# EasyEDA schematic SCH_water-temp_2026-06-27.json
TITLE: WaterTemp; REV: 1.0; Date: 2024-08-01; Sheet: 1/1; Drawn By: bisand; Company: André Biseth
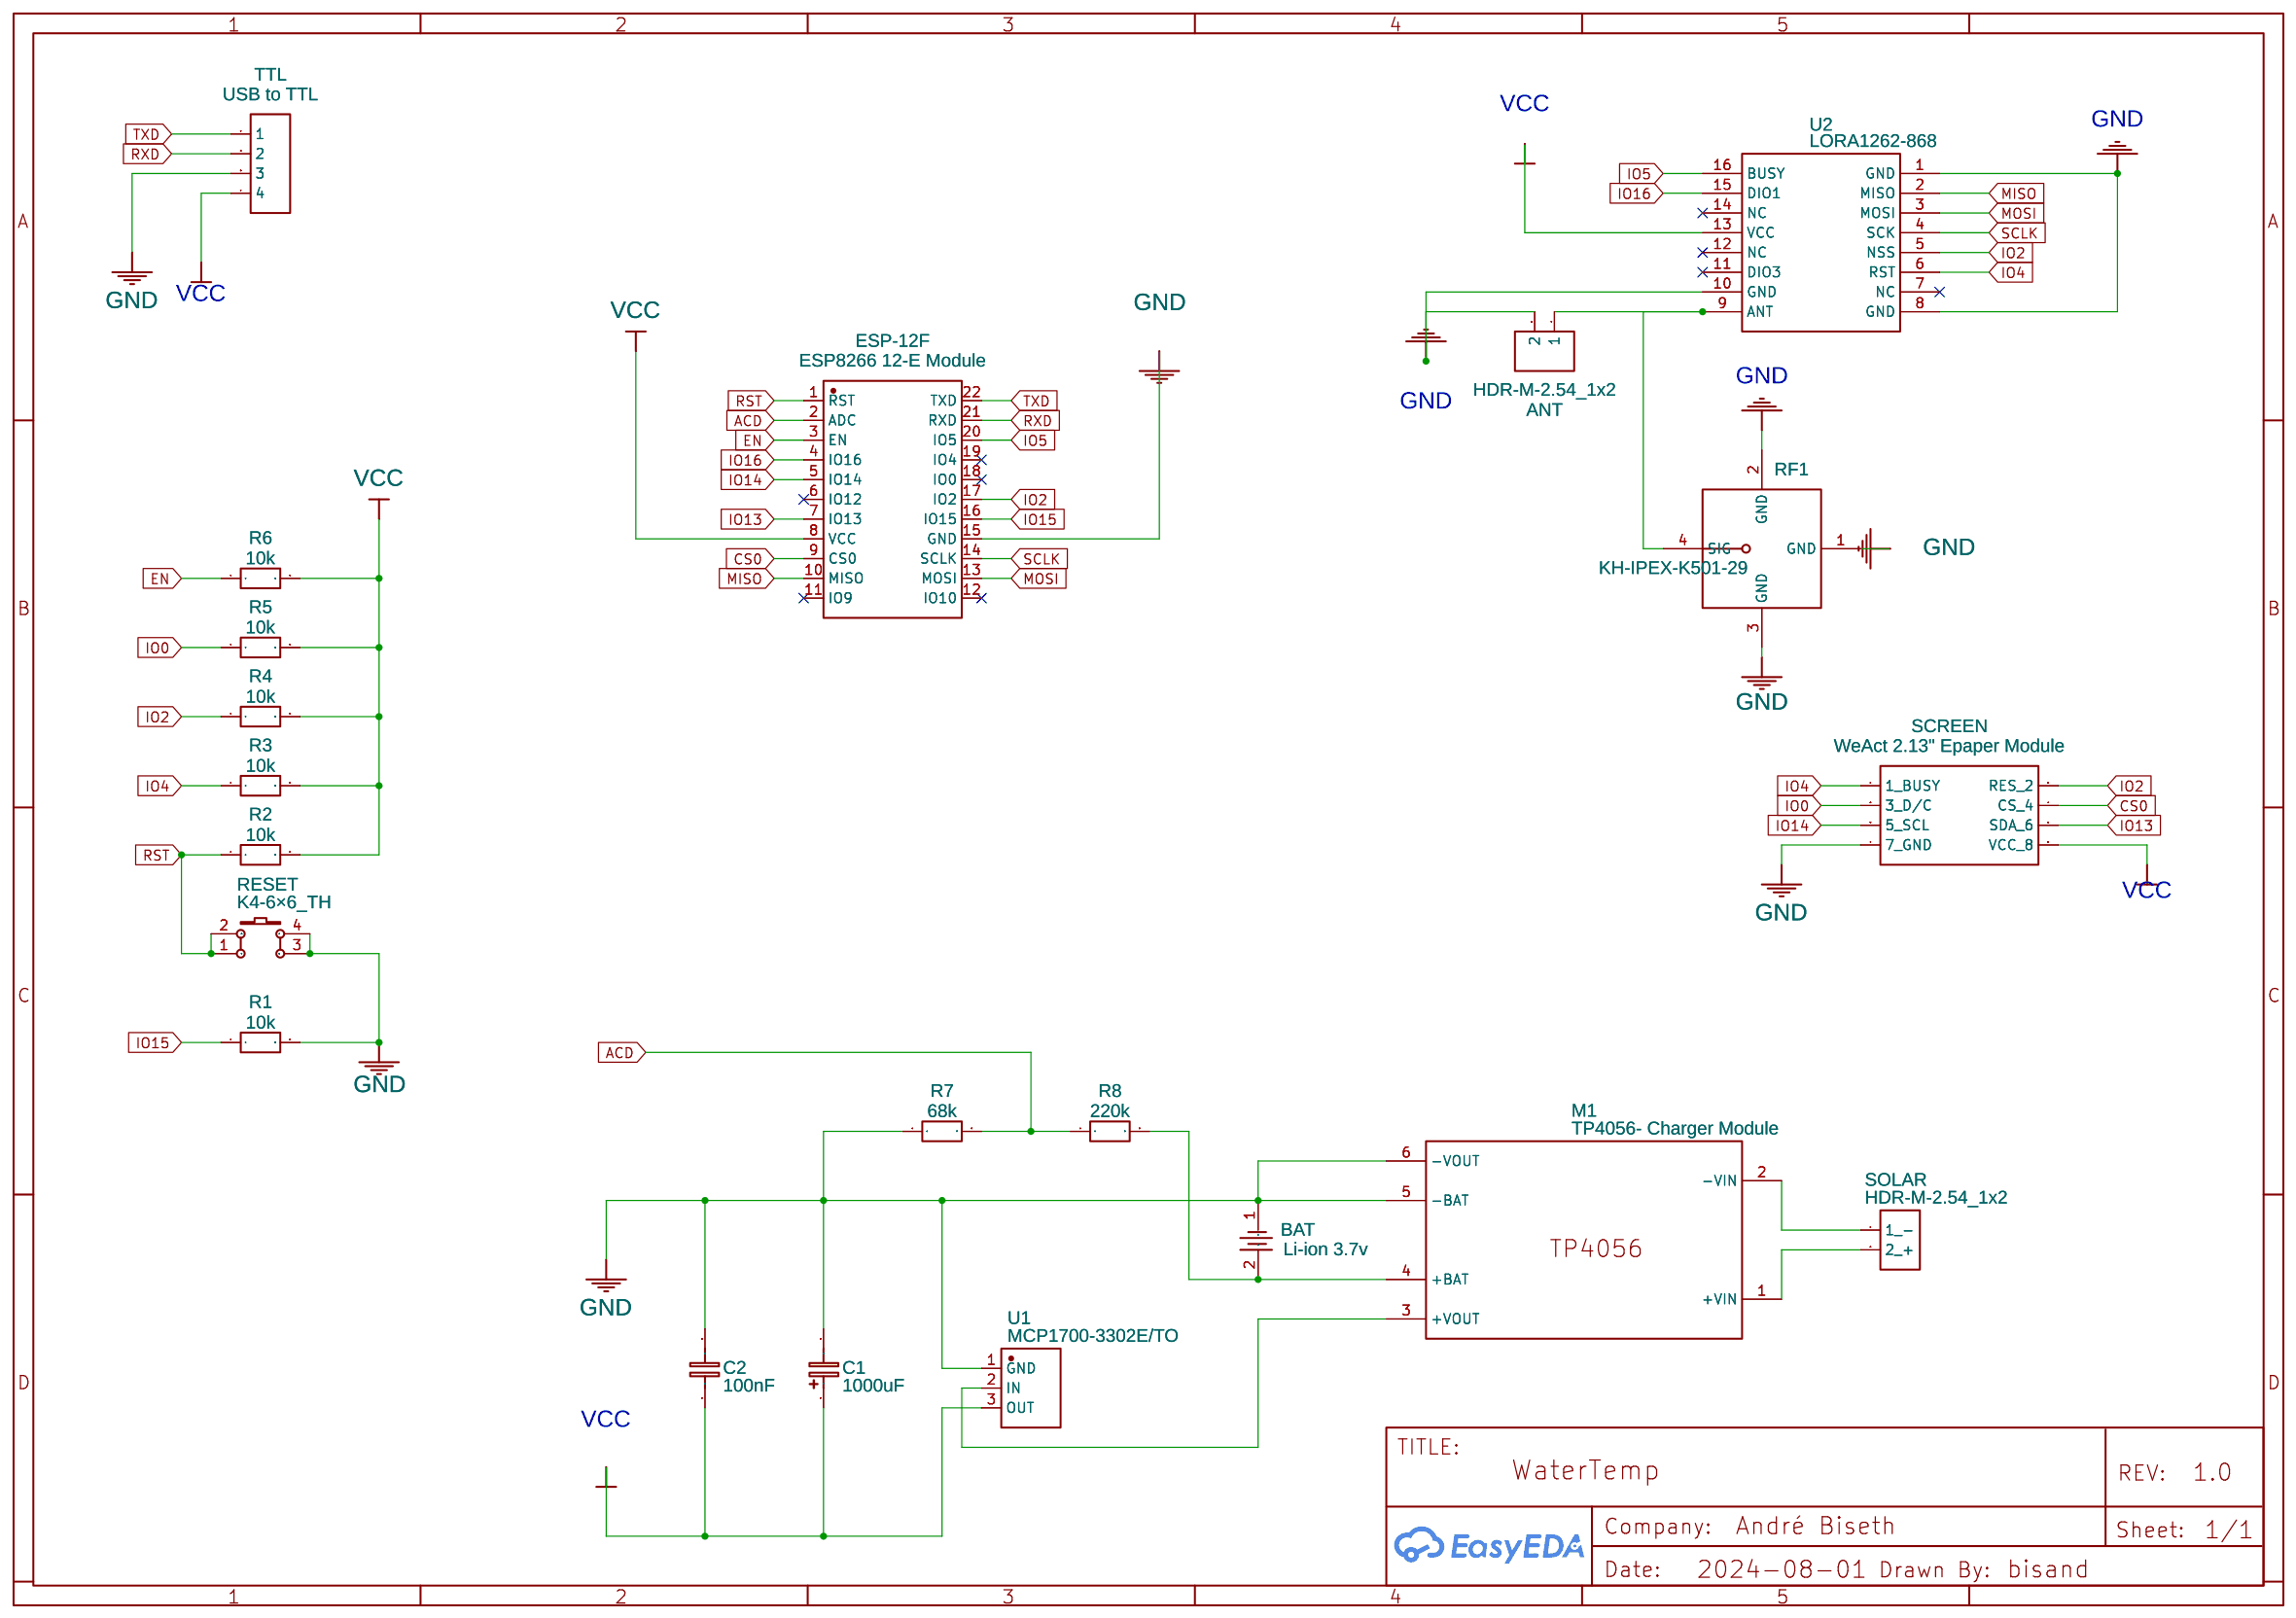
[diagram p0: schematic sheet]

## Parts
ANT  HDR-M-2.54_1x2  [HDR-M-2.54_1X2]
BAT  Li-ion 3.7v  [BATTERY-SMD_18650-1S-L77.1-W20.7-1]
C1  1000uF  [CAP-D8.0×F3.5]
C2  100nF  [RAD-0.1]
ESP-12F  ESP8266 12-E Module  [WIFIM-SMD_ESP-12E-BR]
M1  TP4056- Charger Module  [TP4056-MODULE]
R1  10k  [R_AXIAL-0.3]
R2  10k  [R_AXIAL-0.3]
R3  10k  [R_AXIAL-0.3]
R4  10k  [R_AXIAL-0.3]
R5  10k  [R_AXIAL-0.3]
R6  10k  [R_AXIAL-0.3]
R7  68k  [R_AXIAL-0.3]
R8  220k  [R_AXIAL-0.3]
RESET  K4-6×6_TH  [KEY-TH_4P-L6.0-W6.0-P4.50-LS6.5]
RF1  KH-IPEX-K501-29  [ANT-SMD_KH-IPEX-K501-29]
SCREEN  WeAct 2.13" Epaper Module  [HDR-M-2.54_2X4]
SOLAR  HDR-M-2.54_1x2  [HDR-M-2.54_1X2]
TTL  USB to TTL  [HDR-M-2.54_1X4]
U1  MCP1700-3302E/TO  [TO-92-3_L5.1-W4.1-P1.27-L]
U2  LORA1262-868  [LORA1262-868]

## Library data of the parts
ANT SOLAR = HDR-M-2.54_1x2: Supplier Part: C124375; Supplier: LCSC; Contributor: LCEDA_Lib
BAT = BH-18650-B1BA002: Contributor: lcsc; Supplier: LCSC; Supplier Part: C2988620; Manufacturer: MYOUNG(美阳); JLCPCB Part Class: Extended Part
C1 = CE_TH_D8.0×F3.5_EU: Contributor: LCEDA_Lib
C2 = C_RAD-0.1_EU: Contributor: LCEDA_Lib
ESP-12F = ESP-12E: Supplier: LCSC; Manufacturer: Ai-Thinker(安信可); Supplier Part: C89297; JLCPCB Part Class: Extended Part
M1 = TP4056- Charger Module: Manufacturer: China; Supplier Part: TP4056; Contributor: Darvin995
R1-R6 = R_AXIAL-0.3_EU: Contributor: LCEDA_Lib
R7 R8 = R_AXIAL-0.4_EU: Contributor: LCEDA_Lib
RESET = K4-6×6_TH: Supplier: LCSC; Supplier Part: C136684; Manufacturer: 韩国韩荣; Manufacturer Part: K2-1102DP-E4SW-04; Contributor: LCEDA_Lib
RF1 = KH-IPEX-K501-29: Contributor: LCSC; Supplier: LCSC; Supplier Part: C411563; Manufacturer: kinghelm(金航标); JLCPCB Part Class: Extended Part
SCREEN = WeAct 2.13" Epaper Module: Supplier Part: ld-213ei-bw; Supplier: fibel.no; Manufacturer: WeAct Studio; Manufacturer Part: ld-213ei-bw; Contributor: LCEDA_Lib; link: https://github.com/WeActStudio/WeActStudio.EpaperModule
TTL = HDR-M-2.54_1x4: Supplier Part: C124378; Supplier: LCSC; Contributor: LCEDA_Lib
U1 = MCP1700-3302E/TO: Contributor: LCSC; Supplier: LCSC; Supplier Part: C511277; Manufacturer: MICROCHIP(美国微芯); JLCPCB Part Class: Extended Part
U2 = LORA1262-868: Contributor: John_UWB

## Nets
GND: ANT.2 BAT.1 C1.2 C2.2 ESP-12F.15(GND) M1.5(-BAT) M1.6(-VOUT) R1.2 R7.1 RESET.3 RESET.4 RF1.1(GND) RF1.2(GND) RF1.3(GND) SCREEN.7(7 GND) TTL.3 U1.1(GND) U2.1(GND) U2.8(GND) U2.10(GND)
VCC: C1.1 C2.1 ESP-12F.8(VCC) R2.2 R3.2 R4.2 R5.2 R6.2 SCREEN.8(VCC 8) TTL.4 U1.3(OUT) U2.13(VCC)
ACD: ESP-12F.2(ADC) R7.2 R8.1
CS0: ESP-12F.9(CS0) SCREEN.4(CS 4)
EN: ESP-12F.3(EN) R6.1
IO0: R5.1 SCREEN.3(3 D/C)
IO2: ESP-12F.17(IO2) R4.1 SCREEN.2(RES 2) U2.5(NSS)
IO4: R3.1 SCREEN.1(1 BUSY) U2.6(RST)
IO5: ESP-12F.20(IO5) U2.16(BUSY)
IO13: ESP-12F.7(IO13) SCREEN.6(SDA 6)
IO14: ESP-12F.5(IO14) SCREEN.5(5 SCL)
IO15: ESP-12F.16(IO15) R1.1
IO16: ESP-12F.4(IO16) U2.15(DIO1)
MISO: ESP-12F.10(MISO) U2.2(MISO)
MOSI: ESP-12F.13(MOSI) U2.3(MOSI)
RST: ESP-12F.1(RST) R2.1 RESET.1 RESET.2
RXD: ESP-12F.21(RXD) TTL.2
SCLK: ESP-12F.14(SCLK) U2.4(SCK)
TXD: ESP-12F.22(TXD) TTL.1
Net-(ANT-1): ANT.1 RF1.4(SIG) U2.9(ANT)
Net-(BAT-2): BAT.2 M1.4(+BAT) R8.2
Net-(M1-1): M1.1(+VIN) SOLAR.2(2 +)
Net-(M1-2): M1.2(-VIN) SOLAR.1(1 -)
Net-(M1-3): M1.3(+VOUT) U1.2(IN)

Not connected (* = marked no-connect by the designer): ESP-12F 6(IO12)* 11(IO9)* 12(IO10)* 18(IO0)* 19(IO4)*; U2 7(NC)* 11(DIO3)* 12(NC)* 14(NC)*
